# EAGLE schematic FeatherWing - nRF24L01 v10 (EAGLE 9.7.0)
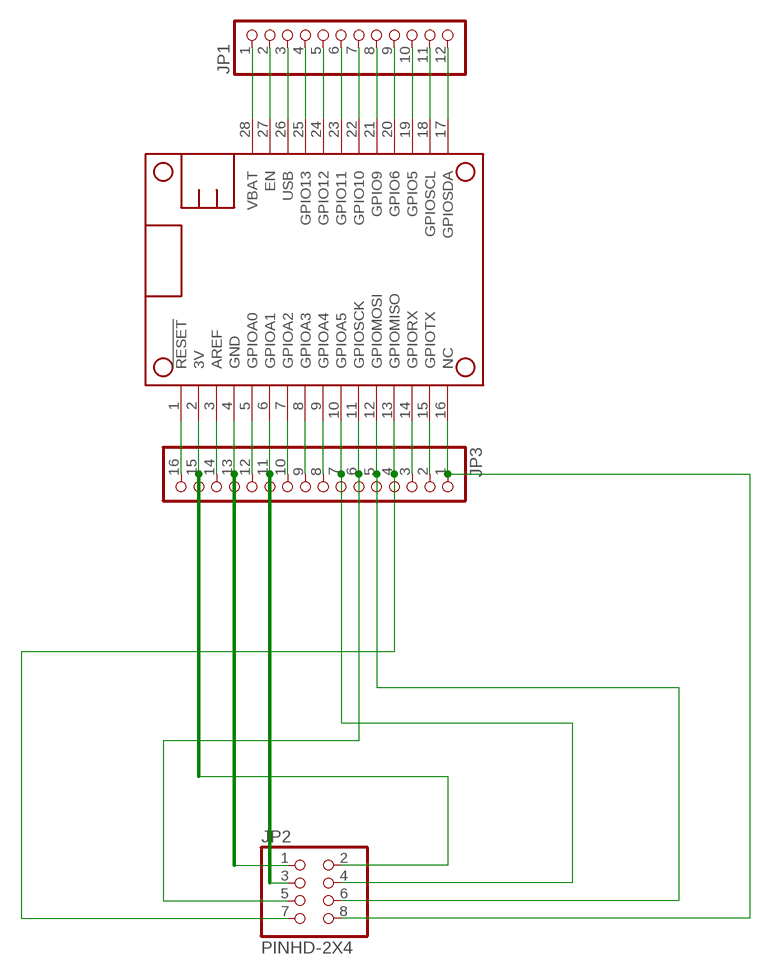
[diagram p0: schematic, sheet 1]

## Parts
JP1  HEADER-1X1276MIL  [1X12_ROUND_76MIL]
JP2  PINHD-2X4  [2X04]
JP3  HEADER-1X16_76MIL  [1X16_ROUND_76MIL]
MS1  FEATHERWING  [FEATHERWING]

## Nets
3V: JP2.2 JP3.15 MS1.2(3V)
AREF: JP3.14 MS1.3(AREF)
CE: JP2.3 JP3.11 MS1.6(GPIOA1)
CNS: JP2.4 JP3.7 MS1.10(GPIOA5)
GND: JP2.1 JP3.13 MS1.4(GND)
IRQ: JP2.8 JP3.1 MS1.16(NC)
MISO: JP2.7 JP3.4 MS1.13(GPIOMISO)
MOSI: JP2.6 JP3.5 MS1.12(GPIOMOSI)
N$1: JP1.2 MS1.27(EN)
N$3: JP1.4 MS1.25(GPIO13)
N$4: JP3.2 MS1.15(GPIOTX)
N$5: JP1.5 MS1.24(GPIO12)
N$6: JP3.3 MS1.14(GPIORX)
N$11: JP3.8 MS1.9(GPIOA4)
N$12: JP3.9 MS1.8(GPIOA3)
N$13: JP3.10 MS1.7(GPIOA2)
N$15: JP3.12 MS1.5(GPIOA0)
N$18: JP3.16 MS1.1(!RESET)
N$19: JP1.6 MS1.23(GPIO11)
N$20: JP1.7 MS1.22(GPIO10)
N$21: JP1.8 MS1.21(GPIO9)
N$22: JP1.9 MS1.20(GPIO6)
N$23: JP1.10 MS1.19(GPIO5)
N$24: JP1.11 MS1.18(GPIOSCL)
N$25: JP1.12 MS1.17(GPIOSDA)
SCK: JP2.5 JP3.6 MS1.11(GPIOSCK)
USB: JP1.3 MS1.26(USB)
VBAT: JP1.1 MS1.28(VBAT)

## Library data of the parts
JP1 = microbuilder:HEADER-1X12
JP2 = Connector:PINHD-2X4: PIN HEADER; CATEGORY: Headers; DESCRIPTION: Header, Straight, 2x4 Position; MANUFACTURER: Generic; MPN: Generic; OPERATING_TEMPERATURE: Generic; PART_STATUS: Active; PITCH: 0.100" (2.54mm); ROHS_COMPLIANCE: Generic; SERIES: Generic; SUB-CATEGORY: Headers, Male Pins; TYPE: Board to Board or Cable, Unshrouded, Through Hole, Straight
JP3 = microbuilder:HEADER-1X16: PIN HEADER
MS1 = microbuilder:FEATHERWING

## Net classes
0 default: width 0.508 mm, clearance 0.508 mm